# EAGLE board ArduinoDevBoardRevA (EAGLE 9.0.1), part 1 of 2
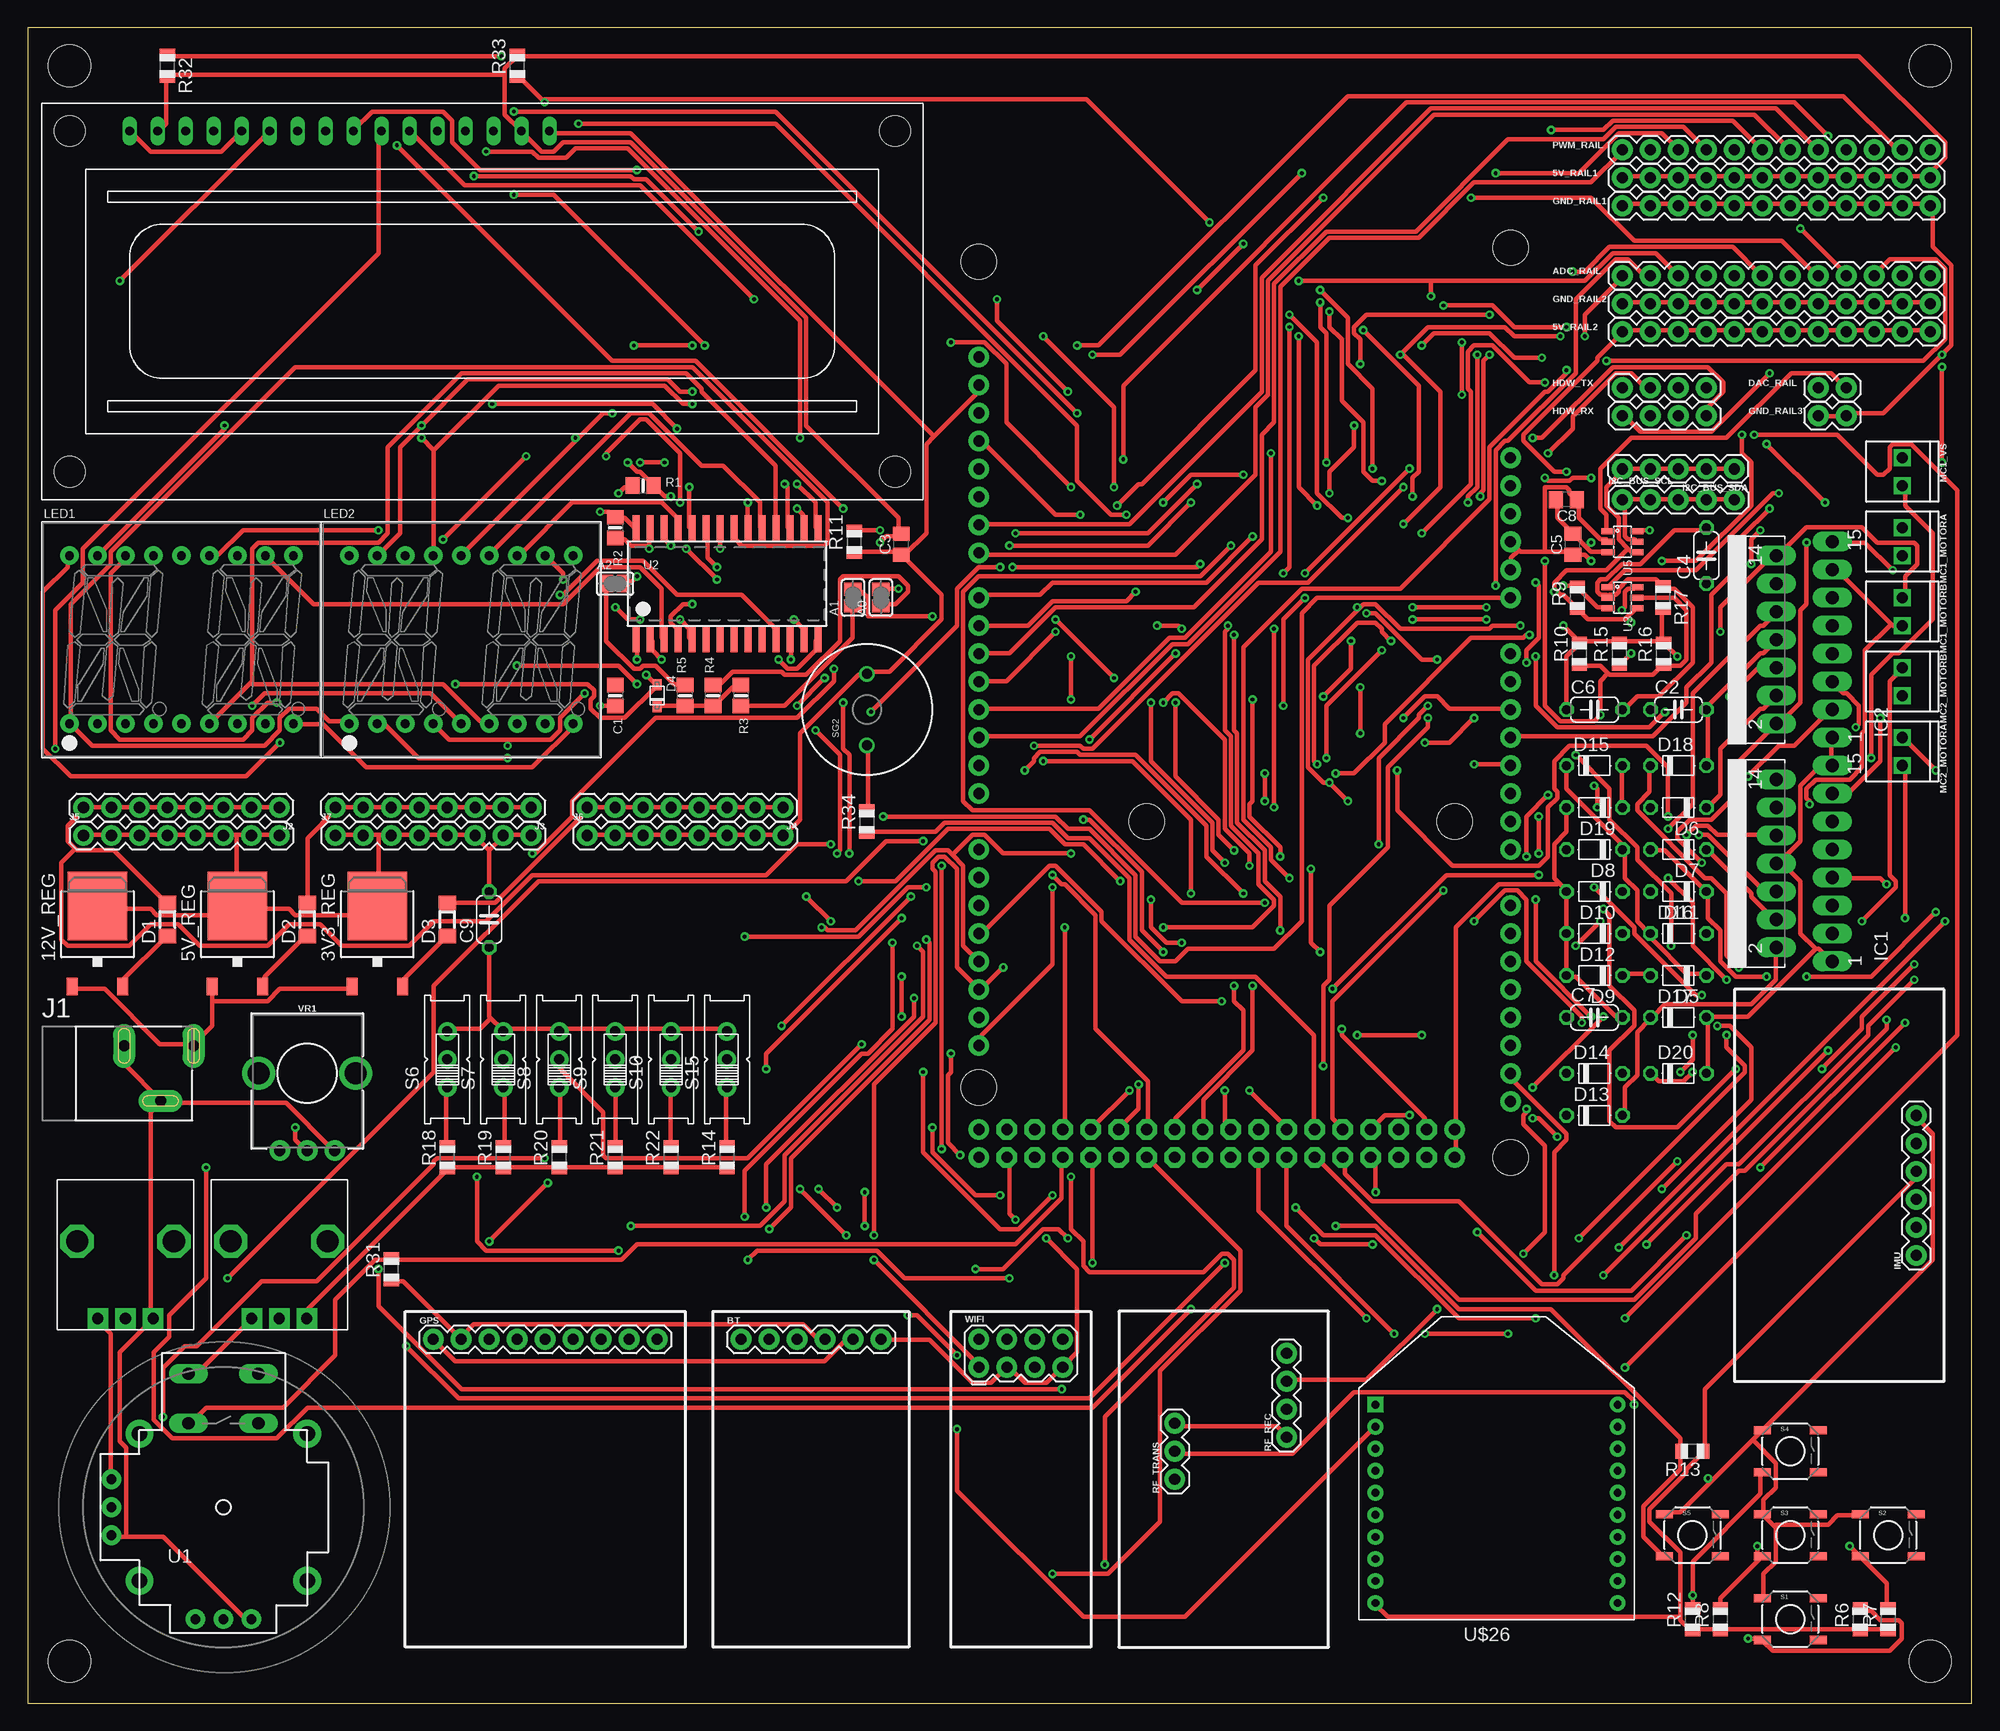
[diagram p2: board, top side]
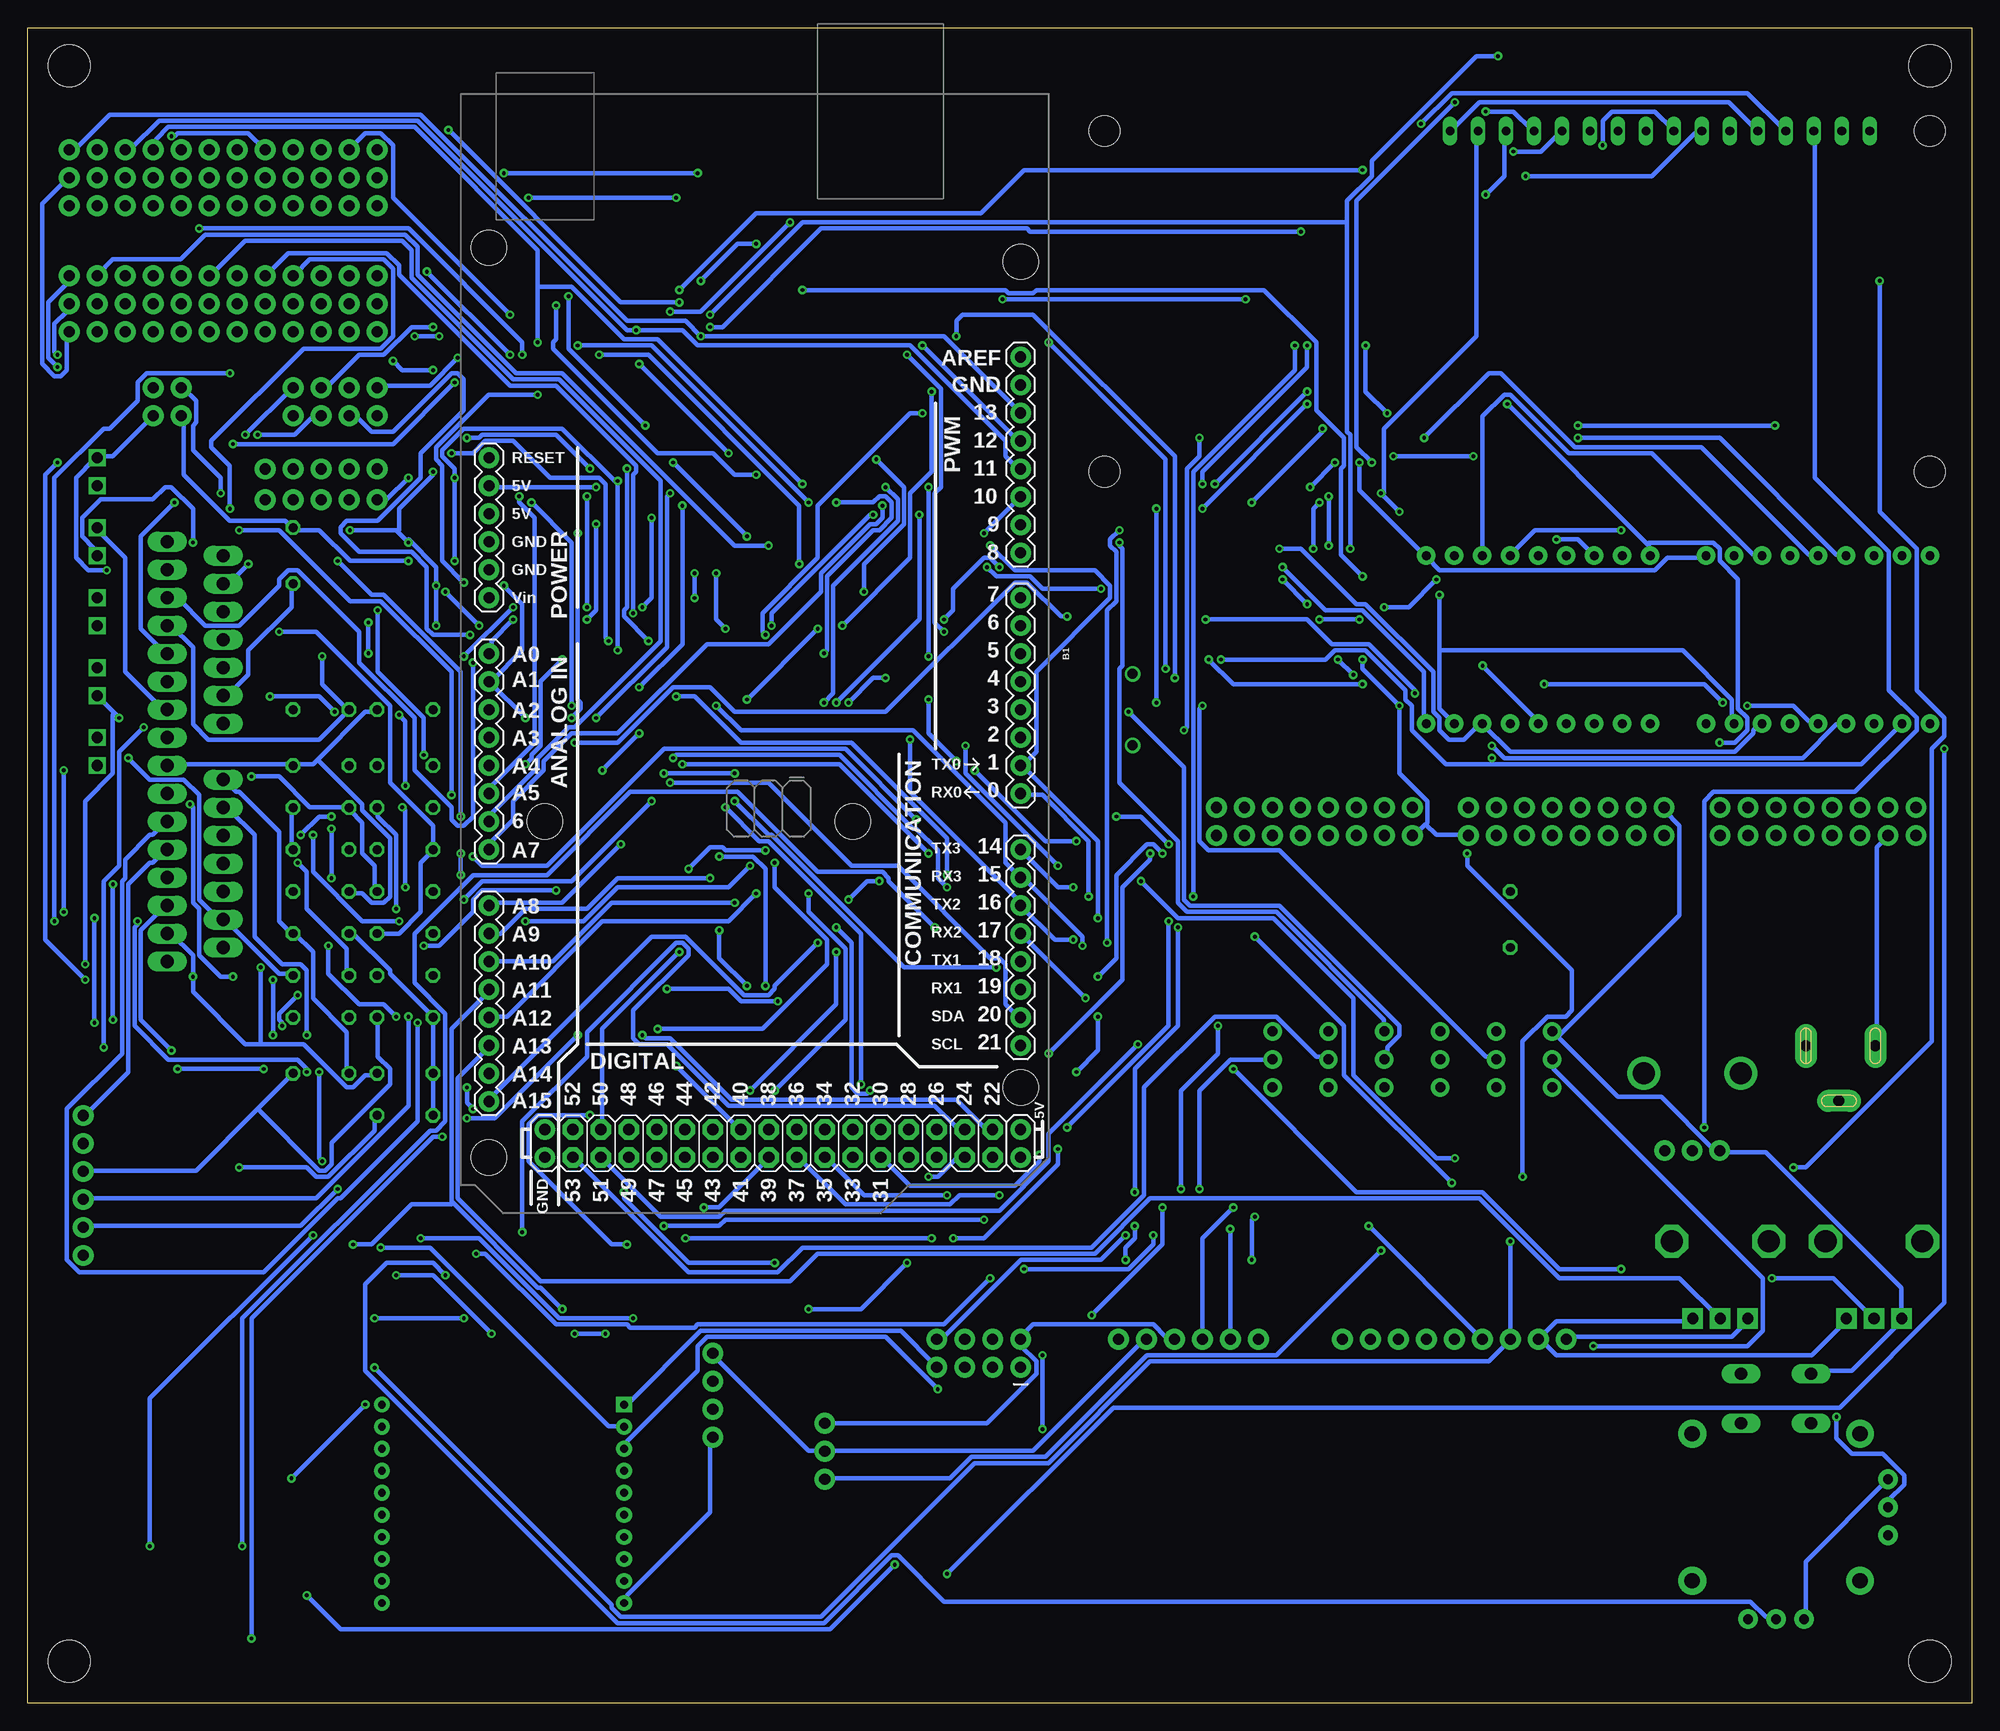
[diagram p3: board, bottom side, seen from below]

Size 176.51 x 152.07 mm. Coordinates in mm from the lower left corner, seen from the top.
Outline: 0,0 176.51,0 176.51,152.07 0,152.07 0,0
Copper layers (1*16): Top 0.035mm / dielectric 1.5mm / Bottom 0.035mm
Design rules "default": minimum track width 6mil, minimum drill 0.35mm, track to track 6mil, track to pad 6mil, pad to pad 6mil, via to via 6mil, smd to smd 6mil, copper to edge 40mil, drill to drill 6mil, minimum pad ring 10mil, minimum via ring 8mil, stop-mask expansion 4mil, vias tented up to drill 0mil, thermal gap 10mil
Net classes: 0 default: width 0.406 mm
Holes 3.81 mm at 3.81,148.59 172.72,148.59 172.72,3.81 3.81,3.81

## Footprints (pad centres in the part's own frame; a part is rotated, then mirrored left to right if it is on the bottom)
TO252 = smd 1 x 1.6: 1 -2.28,-4.8; 2 2.28,-4.8 | smd 5.4 x 6.2: 3 0,2.5
1X12 = drill 1.016 pad 1.88: 1 0,0; 2 2.54,0; 3 5.08,0; 4 7.62,0; 5 10.16,0; 6 12.7,0; 7 15.24,0; 8 17.78,0; 9 20.32,0; 10 22.86,0; 11 25.4,0; 12 27.94,0
SOLDERJUMPER_REFLOW_NOPASTE = smd 1.168 x 1.6: 1 -0.762,0; 2 0.762,0
ARDUINO_MEGA = drill 1.016 pad 1.88: 0 13.97,24.13; 1 11.43,24.13; 2 8.89,24.13; 3 6.35,24.13; 3.3V -13.97,-24.13; 4 3.81,24.13; 5 1.27,24.13; 5V@0 -11.43,-24.13; 5V@1 44.45,24.13; 5V@2 46.99,24.13; 6 -1.27,24.13; 7 -3.81,24.13; 8 -7.874,24.13; 9 -10.414,24.13; 10 -12.954,24.13; 11 -15.494,24.13; 12 -18.034,24.13; 13 -20.574,24.13; 14 19.05,24.13; 15 21.59,24.13; 16 24.13,24.13; 17 26.67,24.13; 18 29.21,24.13; 19 31.75,24.13; 20 34.29,24.13; 21 36.83,24.13; A0 1.27,-24.13; A1 3.81,-24.13; A2 6.35,-24.13; A3 8.89,-24.13; A4 11.43,-24.13; A5 13.97,-24.13; A6 16.51,-24.13; A7 19.05,-24.13; A8 24.13,-24.13; A9 26.67,-24.13; A10 29.21,-24.13; A11 31.75,-24.13; A12 34.29,-24.13; A13 36.83,-24.13; A14 39.37,-24.13; A15 41.91,-24.13; AREF -25.654,24.13; GND@0 -8.89,-24.13; GND@1 -6.35,-24.13; GND@2 44.45,-19.05; GND@3 46.99,-19.05; GND@4 -23.114,24.13; RESET -16.51,-24.13; VIN -3.81,-24.13 | drill 1.016 pad 1.88 octagon: 22 44.45,21.59; 23 46.99,21.59; 24 44.45,19.05; 25 46.99,19.05; 26 44.45,16.51; 27 46.99,16.51; 28 44.45,13.97; 29 46.99,13.97; 30 44.45,11.43; 31 46.99,11.43; 32 44.45,8.89; 33 46.99,8.89; 34 44.45,6.35; 35 46.99,6.35; 36 44.45,3.81; 37 46.99,3.81; 38 44.45,1.27; 39 46.99,1.27; 40 44.45,-1.27; 41 46.99,-1.27; 42 44.45,-3.81; 43 46.99,-3.81; 44 44.45,-6.35; 45 46.99,-6.35; 46 44.45,-8.89; 47 46.99,-8.89; 48 44.45,-11.43; 49 46.99,-11.43; 50 44.45,-13.97; 51 46.99,-13.97; 52 44.45,-16.51; 53 46.99,-16.51 | hole 3.2: -34.29,24.13; -35.56,-24.13; 16.51,8.89; 16.51,-19.05; 40.64,24.13; 46.99,-24.13
1X06 = drill 1.016 pad 1.88: 1 0,0; 2 2.54,0; 3 5.08,0; 4 7.62,0; 5 10.16,0; 6 12.7,0
0805-NO = smd 1.3 x 1.5: 1 -0.95,0; 2 0.95,0
C050-024X044 = drill 0.813 octagon: 1 -2.54,0; 2 2.54,0
0805 = smd 1.27 x 1.524: 1 -0.953,0; 2 0.953,0
SOD-123 = smd 1.3 x 1.6: 1 -1.5,0; 2 1.5,0
SOD-323F = smd 1 x 0.8: A -1,0; C 1,0
D-5 = drill 0.813 octagon: A 2.54,0; C -2.54,0
1X02 = drill 1.016 pad 1.88: 1 0,0; 2 2.54,0
1X09 = drill 1.016 pad 1.88: 1 0,0; 2 2.54,0; 3 5.08,0; 4 7.62,0; 5 10.16,0; 6 12.7,0; 7 15.24,0; 8 17.78,0; 9 20.32,0
1X04 = drill 1.016 pad 1.88: 1 0,0; 2 2.54,0; 3 5.08,0; 4 7.62,0
1X05 = drill 1.016 pad 1.88: 1 0,0; 2 2.54,0; 3 5.08,0; 4 7.62,0; 5 10.16,0
MULTIWATT-15 = drill 1.2 long: 1 -8.89,-7.62; 2 -7.62,-2.54; 3 -6.35,-7.62; 4 -5.08,-2.54; 5 -3.81,-7.62; 6 -2.54,-2.54; 7 -1.27,-7.62; 8 0,-2.54; 9 1.27,-7.62; 10 2.54,-2.54; 11 3.81,-7.62; 12 5.08,-2.54; 13 6.35,-7.62; 14 7.62,-2.54; 15 8.89,-7.62
POWER_JACK_SLOT = drill 1 pad 2 long: GND@1 2.58,7.5; GND@2 7.58,10.8; PWR 2.58,13.8
1X08 = drill 1.016 pad 1.88: 1 0,0; 2 2.54,0; 3 5.08,0; 4 7.62,0; 5 10.16,0; 6 12.7,0; 7 15.24,0; 8 17.78,0
SEGMENT_STARTBUST_DUAL_KWA-541CBB = drill 0.8 pad 1.676: 1 -10.16,-7.62; 2 -7.62,-7.62; 3 -5.08,-7.62; 4 -2.54,-7.62; 5 0,-7.62; 6 2.54,-7.62; 7 5.08,-7.62; 8 7.62,-7.62; 9 10.16,-7.62; 10 10.16,7.62; 11 7.62,7.62; 12 5.08,7.62; 13 2.54,7.62; 14 0,7.62; 15 -2.54,7.62; 16 -5.08,7.62; 17 -7.62,7.62; 18 -10.16,7.62
1X02_2.54_SCREWTERM = drill 1.016 square: P1 2.54,0; P2 0,0
R0805 = smd 1.1 x 1.4: 1 -1,0; 2 1,0
1X03 = drill 1.016 pad 1.88: 1 0,0; 2 2.54,0; 3 5.08,0
TACTILE_SWITCH_SMD = smd 1.524 x 0.762: 1 -2.54,1.905; 2 2.54,1.905; 3 -2.54,-1.905; 4 2.54,-1.905
EG1218 = drill 0.9 pad 1.676: O -2.54,0; P 0,0; S 2.54,0
BUZZER-12MM = drill 0.9: + 3.25,0; - -3.25,0
JOYSTICK = drill 1.1 pad 1.778 long: B1A -3.175,12.12; B1B 3.175,12.12; B2A -3.175,7.62; B2B 3.175,7.62 | drill 0.889 pad 1.778: H1 -2.54,-10.16; H2 0,-10.16; H3 2.54,-10.16; V1 -10.16,2.54; V2 -10.16,0; V3 -10.16,-2.54 | drill 1.397 pad 2.54: MOUNT1 -7.62,6.668; MOUNT2 -7.62,-6.668; MOUNT3 7.62,-6.668; MOUNT4 7.62,6.668
SOP28_300MIL = smd 0.635 x 2.286: P$1 -8.255,-5.08; P$2 -6.985,-5.08; P$3 -5.715,-5.08; P$4 -4.445,-5.08; P$5 -3.175,-5.08; P$6 -1.905,-5.08; P$7 -0.635,-5.08; P$8 0.635,-5.08; P$9 1.905,-5.08; P$10 3.175,-5.08; P$11 4.445,-5.08; P$12 5.715,-5.08; P$13 6.985,-5.08; P$14 8.255,-5.08; P$15 8.255,5.08; P$16 6.985,5.08; P$17 5.715,5.08; P$18 4.445,5.08; P$19 3.175,5.08; P$20 1.905,5.08; P$21 0.635,5.08; P$22 -0.635,5.08; P$23 -1.905,5.08; P$24 -3.175,5.08; P$25 -4.445,5.08; P$26 -5.715,5.08; P$27 -6.985,5.08; P$28 -8.255,5.08
SOT23-6 = smd 0.55 x 1.2: 1 -0.95,-1.3; 2 0,-1.3; 3 0.95,-1.3; 4 0.95,1.3; 5 0,1.3; 6 -0.95,1.3
ALPS_POT = drill 1 pad 1.88 square: P$1 7,-2.5; P$2 7,0; P$3 7,2.5 | drill 2 octagon: P$4 0,-4.4; P$5 0,4.4
XBEE = drill 0.7 pad 1.422 square: 1 -11,5.5 | drill 0.7 pad 1.422: 2 -11,3.5; 3 -11,1.5; 4 -11,-0.5; 5 -11,-2.5; 6 -11,-4.5; 7 -11,-6.5; 8 -11,-8.5; 9 -11,-10.5; 10 -11,-12.5; 11 11,-12.5; 12 11,-10.5; 13 11,-8.5; 14 11,-6.5; 15 11,-4.5; 16 11,-2.5; 17 11,-0.5; 18 11,1.5; 19 11,3.5; 20 11,5.5
POT-PTH-ALPS-KIT = drill 1 pad 1.88: P$1 7,-2.5; P$2 7,0; P$3 7,2.5 | drill 2: P$4 0,-4.4; P$5 0,4.4
2X4 = drill 1.016 pad 1.88: 1 -3.81,-1.27; 2 -3.81,1.27; 3 -1.27,-1.27; 4 -1.27,1.27; 5 1.27,-1.27; 6 1.27,1.27; 7 3.81,-1.27; 8 3.81,1.27
LCD1602 = drill 0.8 long: 1 8,33.46; 2 10.54,33.46; 3 13.08,33.46; 4 15.62,33.46; 5 18.16,33.46; 6 20.7,33.46; 7 23.24,33.46; 8 25.78,33.46; 9 28.32,33.46; 10 30.86,33.46; 11 33.4,33.46; 12 35.94,33.46; 13 38.48,33.46; 14 41.02,33.46; 15 43.56,33.46; 16 46.1,33.46 | hole 2.8: 2.54,2.54; 2.54,33.46; 77.46,33.46; 77.46,2.54

## Placement (x,y rotation side)
3V3_REG  7812DT  [TO252]  31.75,69.85 0 top
5V_RAIL1  [1X12]  144.78,138.43 0 top
5V_RAIL2  [1X12]  144.78,124.46 0 top
5V_REG  7812DT  [TO252]  19.05,69.85 0 top
12V_REG  7812DT  [TO252]  6.35,69.85 0 top
A0  [SOLDERJUMPER_REFLOW_NOPASTE]  77.47,100.33 90 top
A1  [SOLDERJUMPER_REFLOW_NOPASTE]  74.93,100.33 90 top
A2  [SOLDERJUMPER_REFLOW_NOPASTE]  53.34,101.6 0 top
ADC_RAIL  [1X12]  144.78,129.54 0 top
B1  ARDUINO_MEGA_R3FULL  [ARDUINO_MEGA]  110.49,96.52 270 bottom
BT  [1X06]  64.77,33.02 0 top
C1  10uF  [0805-NO]  53.34,91.44 270 top
C2  100nF  [C050-024X044]  149.86,90.17 0 top
C3  0.1uF  [0805]  79.31,105.18 90 top
C4  100nF  [C050-024X044]  152.4,104.14 90 top
C5  0.1uF  [0805]  140.27,105.18 90 top
C6  100nF  [C050-024X044]  142.24,90.17 0 top
C7  100nF  [C050-024X044]  142.24,62.23 0 top
C8  0.1uF  [0805]  139.7,109.22 180 top
C9  4.7uF  [C050-024X044]  41.91,71.12 90 top
D1  [SOD-123]  12.7,71.12 90 top
D2  [SOD-123]  25.4,71.12 90 top
D3  [SOD-123]  38.1,71.12 90 top
D4  1N4148  [SOD-323F]  57.15,91.44 270 top
D5  [D-5]  149.86,66.04 180 top
D6  [D-5]  149.86,81.28 180 top
D7  [D-5]  149.86,77.47 180 top
D8  [D-5]  142.24,77.47 180 top
D9  [D-5]  142.24,66.04 180 top
D10  [D-5]  142.24,73.66 180 top
D11  [D-5]  149.86,73.66 180 top
D12  [D-5]  142.24,69.85 180 top
D13  [D-5]  142.24,53.34 0 top
D14  [D-5]  142.24,57.15 0 top
D15  [D-5]  142.24,85.09 0 top
D16  [D-5]  149.86,69.85 0 top
D17  [D-5]  149.86,62.23 0 top
D18  [D-5]  149.86,85.09 0 top
D19  [D-5]  142.24,81.28 180 top
D20  [D-5]  149.86,57.15 0 top
DAC_RAIL  [1X02]  162.56,119.38 0 top
GND_RAIL1  [1X12]  144.78,135.89 0 top
GND_RAIL2  [1X12]  144.78,127 0 top
GND_RAIL3  [1X02]  162.56,116.84 0 top
GPS  [1X09]  36.83,33.02 0 top
HDW_RX  [1X04]  144.78,116.84 0 top
HDW_TX  [1X04]  144.78,119.38 0 top
I2C_BUS_SCL  [1X05]  144.78,109.22 0 top
I2C_BUS_SDA  [1X05]  154.94,112.01 180 top
IC1  L298  [MULTIWATT-15]  156.21,76.2 90 top
IC2  L298  [MULTIWATT-15]  156.21,96.52 90 top
IMU  [1X06]  171.45,40.64 90 top
J1  POWER_JACKSLT  [POWER_JACK_SLOT]  1.27,62.23 270 top
J2  [1X08]  22.86,81.28 180 top
J3  [1X08]  45.72,81.28 180 top
J4  [1X08]  68.58,81.28 180 top
J5  [1X08]  5.08,78.74 0 top
J6  [1X08]  50.8,78.74 0 top
J7  [1X08]  27.94,78.74 0 top
LED1  [SEGMENT_STARTBUST_DUAL_KWA-541CBB]  13.97,96.52 0 top
LED2  [SEGMENT_STARTBUST_DUAL_KWA-541CBB]  39.37,96.52 0 top
MC1_MOTORA  [1X02_2.54_SCREWTERM]  170.18,106.68 270 top
MC1_MOTORB  [1X02_2.54_SCREWTERM]  170.18,100.33 270 top
MC1_VS  [1X02_2.54_SCREWTERM]  170.18,113.03 270 top
MC2_MOTORA  [1X02_2.54_SCREWTERM]  170.18,87.63 270 top
MC2_MOTORB  [1X02_2.54_SCREWTERM]  170.18,93.98 270 top
PWM_RAIL  [1X12]  144.78,140.97 0 top
R1  10K  [0805-NO]  55.88,110.49 0 top
R2  10K  [0805-NO]  53.34,106.68 270 top
R3  47K  [0805-NO]  64.77,91.44 270 top
R4  47K  [0805-NO]  62.23,91.44 90 top
R5  47K  [0805-NO]  59.69,91.44 90 top
R6  [R0805]  166.37,7.62 90 top
R7  [R0805]  168.91,7.62 90 top
R8  [R0805]  153.67,7.62 90 top
R9  10k  [R0805]  140.69,100.32 90 top
R10  10k  [R0805]  140.87,95.25 90 top
R11  10k  [R0805]  75.05,105.4 90 top
R12  [R0805]  151.13,7.62 90 top
R13  [R0805]  151.13,22.86 180 top
R14  10K  [R0805]  63.5,49.53 90 top
R15  10k  [R0805]  144.5,95.24 90 top
R16  10k  [R0805]  148.51,95.24 90 top
R17  10k  [R0805]  148.47,100.34 270 top
R18  10K  [R0805]  38.1,49.53 90 top
R19  10K  [R0805]  43.18,49.53 90 top
R20  10K  [R0805]  48.26,49.53 90 top
R21  10K  [R0805]  53.34,49.53 90 top
R22  10K  [R0805]  58.42,49.53 90 top
R31  10k  [R0805]  33.02,39.37 90 top
R32  10k  [R0805]  12.7,148.59 270 top
R33  10k  [R0805]  44.45,148.59 90 top
R34  100  [R0805]  76.2,80.01 90 top
RF_REC  [1X04]  114.3,24.13 90 top
RF_TRANS  [1X03]  104.14,20.32 90 top
S1  [TACTILE_SWITCH_SMD]  160.02,7.62 0 top
S2  [TACTILE_SWITCH_SMD]  168.91,15.24 0 top
S3  [TACTILE_SWITCH_SMD]  160.02,15.24 0 top
S4  [TACTILE_SWITCH_SMD]  160.02,22.86 0 top
S5  [TACTILE_SWITCH_SMD]  151.13,15.24 0 top
S6  [EG1218]  38.1,58.42 90 top
S7  [EG1218]  43.18,58.42 90 top
S8  [EG1218]  48.26,58.42 90 top
S9  [EG1218]  53.34,58.42 90 top
S10  [EG1218]  58.42,58.42 90 top
S15  [EG1218]  63.5,58.42 90 top
SG2  BUZZERPTH  [BUZZER-12MM]  76.2,90.17 90 top
U1  JOYSTICKPTH  [JOYSTICK]  17.78,17.78 0 top
U2  [SOP28_300MIL]  63.5,101.6 0 top
U3  MCP4725A1T-E/CH  [SOT23-6]  144.78,100.33 270 top
U5  MCP4725A1T-E/CH  [SOT23-6]  144.78,105.41 270 top
U$12  POT  [ALPS_POT]  22.86,41.91 270 top
U$14  POT  [ALPS_POT]  8.89,41.91 270 top
U$26  XBEE  [XBEE]  133.35,21.59 0 top
VR1  10k  [POT-PTH-ALPS-KIT]  25.4,57.15 270 top
WIFI  [2X4]  90.17,31.75 0 top
X1  HD44780LCD-1602  [LCD1602]  1.27,109.22 0 top

## Tracks (layer width: path | path; a pad name or v marks a point on that pad's centre or on a via)
3.3V  (via drill 0.35)
  Top 0.406: BT.6 77.67,32.97 81.86,32.97 85.78,29.06 87.45,29.06 88.85,30.45 WIFI.3 89.13,30.45 90.53,29.06 92.48,29.06 93.88,30.45 WIFI.7 94.16,30.73 95.28,31.85 95.28,39.4 v92.48,42.19 | v124.89,110.36 116.23,101.7 111.76,101.7 96.67,86.61 95.83,86.61 95.56,86.89 v91.36,86.89 | v82.98,50.29 v82.98,76
  Bottom 0.406: U$26.1 122.1,27.1 115.39,33.81 97.23,33.81 94.16,30.73 WIFI.7 | v124.89,110.36 134.39,110.36 B1.3.3V | v91.36,86.89 91.36,84.38 v82.98,76 | v82.98,50.29 82.98,48.9 89.69,42.19 v92.48,42.19
5V  (via drill 0.35)
  Top 0.406: U3.3 143.33,99.47 142.49,99.47 140.82,101.14 R9.2 140.54,101.42 v139.42,101.42 | 141.52,104.92 140.54,105.89 C5.2 140.26,106.17 138.86,107.57 138.86,108.97 C8.2 | 141.52,104.92 141.94,104.5 143.33,104.5 U5.3 | v147.24,106.45 146.13,106.45 U5.6 | 141.52,104.92 v141.94,105.33 | 148.36,96.39 148.36,99.19 R17.2 | R10.2 141.1,96.39 144.45,96.39 R15.2 144.73,96.39 148.36,96.39 | 148.36,96.39 R16.2 148.64,96.11 v149.76,95 | C6.1 139.7,95 140.82,96.11 R10.2 | v139.42,97.79 140.82,96.39 R10.2 | 5V_RAIL2.12 172.67,124.61 170.43,124.61 5V_RAIL2.11 170.16,124.61 167.64,124.61 | 167.64,124.61 165.12,124.61 5V_RAIL2.9 164.85,124.61 162.61,124.61 5V_RAIL2.8 162.33,124.61 160.1,124.61 5V_RAIL2.7 159.82,124.61 157.58,124.61 5V_RAIL2.6 157.3,124.61 155.07,124.61 5V_RAIL2.5 154.79,124.61 152.55,124.61 5V_RAIL2.4 152.27,124.61 150.04,124.61 5V_RAIL2.3 149.76,124.61 147.52,124.61 5V_RAIL2.2 147.24,124.61 145.01,124.61 5V_RAIL2.1 144.73,124.33 142.49,122.1 142.49,121.82 135.79,115.11 135.79,114.55 138.58,111.76 v139.7,111.76 | 167.64,124.61 5V_RAIL2.10 | 5V_RAIL1.1 145.01,138.58 147.24,138.58 5V_RAIL1.2 147.52,138.58 149.76,138.58 5V_RAIL1.3 150.04,138.58 152.27,138.58 5V_RAIL1.4 152.55,138.58 154.79,138.58 5V_RAIL1.5 155.07,138.58 157.3,138.58 5V_RAIL1.6 157.58,138.58 159.82,138.58 5V_RAIL1.7 160.1,138.58 162.33,138.58 5V_RAIL1.8 162.61,138.58 164.85,138.58 5V_RAIL1.9 165.12,138.58 167.64,138.58 | 167.64,138.58 170.16,138.58 5V_RAIL1.11 170.43,138.58 172.67,138.58 5V_RAIL1.12 172.95,138.58 172.95,139.14 174.07,140.26 174.07,141.66 166.24,149.48 44.7,149.48 R33.2 44.42,149.48 43.31,148.36 43.31,147.8
  Top 0.406: 167.64,138.58 5V_RAIL1.10 | U2.P$28 55.04,106.73 54.2,107.57 53.37,107.57 R2.1 53.09,107.85 52.81,108.13 v51.97,108.13 | v53.65,109.8 54.2,110.36 54.76,110.36 R1.1 | X1.2 12.01,142.77 12.57,143.33 12.57,147.52 R32.2 12.85,147.8 43.31,147.8 | 43.31,147.8 43.31,144.17 44.7,142.77 X1.15 44.98,142.49 46.66,140.82 47.78,140.82 48.62,141.66 54.76,141.66 70.69,125.73 70.69,115.95 79.07,107.57 79.07,106.17 C3.2 79.07,105.89 77.95,105.89 v77.39,105.33 | 158.56,16.07 S3.1 157.58,17.32 157.58,18.44 158.7,19.56 158.7,21.79 156.6,23.89 | 158.56,16.07 158.7,15.93 158.7,12.85 157.58,11.73 157.58,9.78 S1.1 | S2.1 166.24,17.04 164.29,17.04 163.45,16.2 158.7,16.2 158.56,16.07 | 156.6,23.89 S4.1 172.95,40.23 172.95,51.69 171.55,53.09 IMU.6 | 156.6,23.89 152.97,20.26 | 152.97,20.26 150.04,17.32 148.64,17.32 S5.1 | D2.2 25.43,72.64 25.43,78.51 27.94,81.03 J3.8 27.94,81.31 30.45,81.31 J3.7 30.73,81.31 32.97,81.31 J3.6 33.25,81.31 35.48,81.31 J3.5 35.76,81.31 38,81.31 J3.4 38.28,81.31 40.51,81.31 J3.3 40.79,81.31 43.03,81.31 J3.2 43.31,81.31 45.54,81.31 J3.1 | S15.S 63.42,61.19 58.67,61.19 S10.S 58.4,61.19 53.37,61.19 S9.S 53.09,61.19 48.34,61.19 S8.S 48.06,61.19 43.31,61.19 S7.S 43.03,61.19 42.05,62.17 | C9.1 41.91,62.31 42.05,62.17 | 42.05,62.17 41.07,61.19 38.28,61.19 S6.S | U1.B1A 14.81,30.18 15.65,30.18 20.12,34.65 U$12.P$1 | U1.V1 7.54,20.4 7.54,33.53 6.43,34.65 U$14.P$1 | GPS.1 38.84,31.01 72.36,31.01 74.32,32.97 74.88,32.97 BT.5 | v152.55,20.4 152.83,20.4 152.97,20.26 | v145.85,27.1 145.85,27.38 145.01,28.22 120.42,28.22 114.83,22.63 104.22,22.63 RF_TRANS.2
  Bottom 0.406: v147.24,106.45 143.05,106.45 142.91,106.31 | 142.91,106.31 v141.94,105.33 141.94,105.61 139.42,103.1 v139.42,101.42 v139.42,97.79 | IC2.9 163.45,97.79 161.49,95.83 161.49,88.85 160.1,87.45 150.04,87.45 C2.1 147.52,90.25 149.76,92.48 v149.76,95 | 5V_RAIL2.12 172.95,124.33 172.95,120.98 173.51,120.42 174.07,120.42 175.18,121.54 175.18,136.07 172.95,138.3 5V_RAIL1.12 | v139.7,111.76 139.7,111.48 142.77,108.41 142.77,106.45 142.91,106.31 | v51.97,108.13 v53.65,109.8 53.37,109.8 53.37,115.67 44.98,124.05 44.98,142.49 X1.15 | IC1.9 164.01,77.39 165.12,76.28 165.41,76.28 167.36,74.32 167.36,57.28 171.27,53.37 IMU.6 | J3.8 27.94,81.03 26.54,79.63 26.54,71.53 37.44,60.63 S6.S 38,60.91 32.13,55.04 28.22,55.04 23.47,50.29 22.91,50.29 VR1.P$1 22.63,50.01 18.72,50.01 6.43,37.72 6.43,34.92 U$14.P$1 6.43,34.65 10.9,30.18 14.53,30.18 U1.B1A | RF_REC.4 114.28,31.57 105.61,22.91 104.22,22.91 RF_TRANS.2 103.94,22.91 85.22,22.91 75.16,32.97 BT.5 | GPS.1 36.6,33.25 21.79,33.25 20.4,34.65 U$12.P$1 | U1.V1 15.09,12.85 15.09,7.82 U1.H1 | v145.85,27.1 v152.55,20.4 | v77.39,105.33 77.39,105.05 77.11,104.78 77.11,94.16 77.39,93.88 77.39,83.54 72.08,78.23 72.08,72.64 71.25,71.81 63.14,71.81 53.37,62.03 53.37,61.19 S9.S
12V  (via drill 0.35)
  Top 0.406: J2.1 22.63,81.31 20.4,81.31 J2.2 20.12,81.31 17.88,81.31 J2.3 17.6,81.31 15.37,81.31 J2.4 15.09,81.31 12.85,81.31 J2.5 12.57,81.31 10.34,81.31 J2.6 10.06,81.31 7.82,81.31 J2.7 7.54,81.31 5.31,81.31 J2.8 5.03,81.03 3.63,79.63 3.63,78.23 4.33,77.53 | 4.33,77.53 4.47,77.39 7.82,77.39 12.57,72.64 D1.2 | v77.67,80.47 93.32,80.47 94.44,79.35 96.39,79.35 100.58,75.16 100.58,69.57 102.82,67.33 104.22,67.33 105.33,68.45 113.16,68.45 115.67,70.97 115.67,98.91 117.07,100.31 134.39,100.31 B1.VIN | v72.92,77.95 69.85,77.95 67.06,75.16 45.82,75.16 41.63,70.97 36.88,70.97 34.65,68.73 28.5,68.73 26.54,70.69 23.75,70.69 21.79,68.73 15.65,68.73 13.69,70.69 11.18,70.69 9.22,68.73 3.63,68.73 3.07,69.29 3.07,76.28 4.33,77.53
  Bottom 0.406: v77.67,80.47 75.44,80.47 v72.92,77.95
A0  (via drill 0.35)
  Top 0.406: v62.59,103.1 61.75,103.94 61.75,106.45 U2.P$23 | LED1.9 24.31,88.85 26.82,88.85 30.73,84.94 45.82,84.94 49.73,88.85 LED2.9
  Bottom 0.406: v62.59,103.1 58.67,99.19 55.32,99.19 49.73,93.6 49.73,89.13 LED2.9
A1  (via drill 0.35)
  Top 0.406: v60.07,110.36 60.07,106.73 U2.P$24 | v55.6,112.6 v57.84,112.6
  Bottom 0.406: v57.84,112.6 v60.07,110.36 | v55.6,112.6 55.6,110.08 49.73,104.22 LED2.10 49.45,103.94 48.34,102.82 28.78,102.82 27.66,103.94 24.31,103.94 LED1.10
A2
  Top 0.406: U2.P$25 58.95,106.73 58.95,107.57 57.56,108.97 49.45,108.97 44.7,104.22 LED2.12
  Bottom 0.406: LED1.12 19.28,104.22 19.84,104.22 29.06,113.44 36.6,113.44 41.91,118.75 42.47,118.75 44.42,116.79 44.42,104.22 LED2.12
ADC1  (via drill 0.35)
  Top 0.406: v79.07,101.14 77.67,101.14 A0.2 | v89.41,103.1 106.17,103.1 v106.45,103.38 | v139.14,124.05 134.95,124.05 134.11,124.89 127.13,124.89 v124.61,122.38 124.89,122.38 128.25,119.02 128.25,110.36 v124.89,107.01 | v141.38,124.05 141.38,126.01 144.73,129.36 ADC_RAIL.1 | v125.73,98.35 v132.44,98.35
  Bottom 0.406: v79.07,101.14 84.38,101.14 85.5,102.26 88.57,102.26 v89.41,103.1 | v106.45,103.38 106.45,108.69 120.14,122.38 v124.61,122.38 | v141.38,124.05 v139.14,124.05 | v132.44,98.35 134.39,96.39 134.39,95.28 B1.A0 | v125.73,98.35 124.89,99.19 v124.89,107.01
ADC2  (via drill 0.35)
  Top 0.406: v82.14,98.63 76.28,98.63 76.28,100.31 75.72,100.86 75.16,100.86 A1.2 | v126.85,87.17 129.08,87.17 v131.32,89.41 | v133.27,101.42 133.27,113.72 134.11,114.55 134.39,114.55 140.54,120.7 140.54,127.41 144.17,131.04 145.29,131.04 146.69,129.64 147.24,129.64 ADC_RAIL.2
  Bottom 0.406: v82.14,98.63 82.7,98.63 85.78,101.7 86.89,101.7 98.63,89.97 112.32,89.97 114.55,92.2 117.91,92.2 122.94,87.17 v126.85,87.17 | v131.32,89.41 B1.A1 134.39,92.76 131.6,95.56 131.6,99.75 v133.27,101.42
ADC3  (via drill 0.35)
  Top 0.406: v55.32,102.26 54.76,101.7 54.2,101.7 A2.2 | v110.36,132.44 v106.17,128.25 | 127.41,129.08 141.38,129.08 143.89,131.6 147.8,131.6 ADC_RAIL.3 | 127.41,129.08 v115.39,129.08 | v124.89,89.41 126.85,91.36 127.97,91.36 129.08,90.25 134.39,90.25 B1.A2 | v118.19,109.8 118.19,111.76 120.42,114 v120.42,115.95 | 127.41,129.08 v127.41,127.69
  Bottom 0.406: v55.32,102.26 57.28,104.22 57.28,112.04 57,112.32 57,114.83 59.51,117.35 59.51,123.5 64.26,128.25 84.94,128.25 85.22,127.97 87.45,127.97 87.73,128.25 v106.17,128.25 | v110.36,132.44 112.04,132.44 v115.39,129.08 | v124.89,89.41 118.47,95.83 118.47,109.53 v118.19,109.8 | v120.42,115.95 127.41,122.94 v127.41,127.69
ADC4  (via drill 0.35)
  Top 0.406: v158.14,108.41 155.63,105.89 155.63,103.38 152.83,100.58 152.83,94.44 150.6,92.2 150.6,90.81 147.52,87.73 134.67,87.73 B1.A3
  Bottom 0.406: v158.14,108.41 158.14,112.32 159.82,114 159.82,114.55 151.44,122.94 144.45,122.94 143.33,124.05 143.33,130.2 144.17,131.04 150.88,131.04 152.27,129.64 ADC_RAIL.4
ADC5  (via drill 0.35)
  Top 0.406: v131.32,85.22 134.39,85.22 B1.A4 | v127.97,94.72 126.57,94.72 122.38,98.91 v121.54,98.91
  Bottom 0.406: v131.32,85.22 130.76,85.78 130.76,86.06 129.92,86.89 129.92,92.76 v127.97,94.72 | v121.54,98.91 121.54,111.48 121.26,111.76 121.26,112.32 128.52,119.58 132.72,119.58 142.77,129.64 142.77,130.48 143.89,131.6 152.83,131.6 154.79,129.64 ADC_RAIL.5
ADC6  (via drill 0.35)
  Top 0.406: v131.88,109.53 131.88,109.8 132.16,110.08 132.16,121.82 v132.72,122.38 | v140.26,129.92 141.38,129.92 143.61,132.16 154.79,132.16 157.3,129.64 ADC_RAIL.6
  Bottom 0.406: v131.88,109.53 131.88,108.97 130.48,107.57 130.48,87.17 134.39,83.26 134.39,82.7 B1.A5 | v140.26,129.92 v132.72,122.38
ADC7
  Bottom 0.406: B1.A6 134.39,80.19 134.39,80.75 130.2,84.94 130.2,85.78 127.41,88.57 126.85,88.57 119.02,96.39 119.02,110.92 128.25,120.14 132.44,120.14 141.66,129.36 141.66,131.88 142.49,132.72 156.74,132.72 159.82,129.64 ADC_RAIL.7
ADC8  (via drill 0.35)
  Top 0.406: v98.91,108.69 100.86,110.64 101.14,110.64 111.48,120.98 111.48,130.48 v117.63,136.63 | v131.04,136.63 141.94,136.63 145.85,132.72 159.26,132.72 162.33,129.64 ADC_RAIL.8
  Bottom 0.406: v98.91,108.69 98.91,107.57 99.47,107.01 100.03,107.01 104.5,102.54 104.5,100.86 109.25,96.11 114.83,96.11 122.94,88.01 127.13,88.01 129.64,85.5 129.64,84.66 132.44,81.86 132.44,80.19 134.39,78.23 134.39,77.67 B1.A7 | v131.04,136.63 v117.63,136.63
ADC9  (via drill 0.35)
  Top 0.406: v122.66,77.95 122.66,85.78 126.29,89.41 126.29,89.69 v127.13,90.53 | v130.76,108.97 130.76,109.53 131.6,110.36 v131.6,122.38 | v160.93,133.83 165.12,129.64 ADC_RAIL.9
  Bottom 0.406: v122.66,77.95 127.97,72.64 134.39,72.64 B1.A8 | v127.13,90.53 127.13,105.33 v130.76,108.97 | v131.6,122.38 131.6,123.5 141.94,133.83 v160.93,133.83
ADC10  (via drill 0.35)
  Top 0.406: v114.55,74.88 112.88,76.56 112.88,77.67 110.36,80.19 110.36,95.83 115.67,101.14 124.61,101.14 132.72,109.25 132.72,114 137.74,119.02 138.02,119.02 139.7,120.7 v139.7,120.98 | v143.33,121.82 172.11,121.82 174.07,123.77 174.07,130.2 173.23,131.04 169.04,131.04 167.64,129.64 ADC_RAIL.10
  Bottom 0.406: B1.A9 133.55,69.85 131.32,72.08 125.73,72.08 122.94,74.88 v114.55,74.88 | v139.7,120.98 142.49,120.98 v143.33,121.82
ADC11  (via drill 0.35)
  Top 0.406: v112.32,72.64 104.78,72.64 96.39,81.03 85.78,81.03 84.94,81.86 84.94,100.86 86.33,102.26 106.45,102.26 v109.25,105.05
  Bottom 0.406: v112.32,72.64 123.5,72.64 128.8,67.33 134.39,67.33 B1.A10 | v109.25,105.05 112.32,105.05 127.97,120.7 132.16,120.7 141.1,129.64 141.1,132.16 142.22,133.27 160.38,133.27 162.61,131.04 168.76,131.04 170.16,129.64 ADC_RAIL.11
ADC12  (via drill 0.35)
  Top 0.406: v127.97,35.76 121.54,29.34 114.55,29.34 RF_REC.3 | v173.79,112.6 v173.79,121.26 | v171.27,65.66 167.08,61.47 167.08,60.63 155.35,48.9 154.23,48.9 v146.96,41.63
  Bottom 0.406: v127.97,35.76 129.92,37.72 130.2,37.72 137.88,45.4 | 137.88,45.4 138.02,45.54 138.02,61.19 134.67,64.54 B1.A11 | v173.79,121.26 174.62,122.1 174.62,127.13 172.95,128.8 172.95,129.36 ADC_RAIL.12 | v173.79,112.6 174.9,111.48 174.9,69.29 v171.27,65.66 | v146.96,41.63 145.29,41.63 141.66,45.26 138.02,45.26 137.88,45.4
BUTTON1  (via drill 0.35)
  Top 0.406: R6.2 166.52,8.38 167.36,8.38 168.2,7.54 169.88,7.54 170.16,7.26 170.16,5.87 169.04,4.75 158.42,4.75 157.58,5.59 S1.3 157.3,5.87 v156.19,5.87 | v126.57,60.63 v120.7,60.63 | v136.63,53.09 137.19,53.09 v138.86,51.41
  Bottom 0.406: v120.7,60.63 120.42,60.35 118.19,60.35 112.6,54.76 92.2,54.76 89.69,52.25 89.13,52.25 B1.22 | v126.57,60.63 134.11,53.09 v136.63,53.09 | v138.86,51.41 139.7,51.41 156.19,34.92 v156.19,5.87
BUTTON2  (via drill 0.35)
  Top 0.406: S5.3 148.36,13.41 146.69,15.09 146.69,17.88 150.04,21.23 150.04,22.63 R13.2 150.04,22.91 150.04,24.03 138.3,35.76 129.92,35.76 122.38,43.31 v118.75,43.31 | v89.69,43.87 89.13,44.42 89.13,49.45 B1.23
  Bottom 0.406: v89.69,43.87 113.16,43.87 113.72,43.31 v118.75,43.31
BUTTON3  (via drill 0.35)
  Top 0.406: R7.2 168.76,8.66 168.76,10.9 166.52,13.13 S2.3 166.24,13.41 v165.41,14.25 | v131.6,42.75 136.91,37.44 145.57,37.44 v150.6,42.47
  Bottom 0.406: v131.6,42.75 131.6,52.81 125.73,58.67 125.73,60.91 117.63,69.01 117.07,69.01 116.51,68.45 116.51,67.89 121.54,62.87 121.54,60.35 120.98,59.79 118.47,59.79 112.88,54.2 94.16,54.2 92.2,52.25 91.64,52.25 B1.24 | v150.6,42.47 165.41,27.66 v165.41,14.25
BUTTON4  (via drill 0.35)
  Top 0.406: R12.2 151.16,8.66 v151.16,9.78 151.16,12.85 157.3,19 157.3,20.95 S4.3 | v94.72,47.78 94.72,43.03 95.83,41.91 95.83,39.67 96.39,39.12 106.73,39.12 108.41,40.79 108.97,40.79 109.53,40.23 109.53,37.72 97.79,25.98 v97.79,12.57
  Bottom 0.406: v94.72,47.78 93.88,47.78 92.2,49.45 91.64,49.45 B1.25 | v97.79,12.57 103.66,6.71 148.08,6.71 v151.16,9.78
BUTTON5  (via drill 0.35)
  Top 0.406: R8.2 153.67,9.5 157.3,13.13 S3.3 157.02,13.13 v157.02,14.25 | v94.16,70.41 94.16,52.25 B1.26
  Bottom 0.406: v94.16,70.41 98.35,74.6 98.35,74.88 98.91,75.44 104.78,75.44 112.04,82.7 121.82,82.7 129.36,75.16 136.07,75.16 141.38,69.85 141.38,65.38 138.58,62.59 138.58,52.81 139.42,51.97 139.98,51.97 157.02,34.92 v157.02,14.25
BUZZER
  Top 0.406: R34.1 76.28,79.07 82.42,79.07 83.26,79.91 93.04,79.91 94.44,78.51 96.39,78.51 100.03,74.88 100.03,69.29 103.38,65.94 111.48,65.94 116.79,60.63 116.79,52.25 B1.44
COM0  (via drill 0.35)
  Top 0.406: v56.16,93.32 57,92.48 D4.A 57,92.2 54.2,89.41 51.97,89.41 51.13,90.25 51.13,91.08 51.41,91.36 51.41,91.92 50.85,92.48 v38.84,92.48 | v57.56,94.72 56.72,95.56 56.72,96.39 U2.P$2 | v22.63,90.81 21.79,90.81 20.4,89.41 20.4,88.29 19.56,87.45 8.38,87.45 7.54,88.29 7.54,102.54 8.94,103.94 LED1.16
  Bottom 0.406: v57.56,94.72 v56.16,93.32 | v38.84,92.48 24.31,92.48 v22.63,90.81
COM1
  Top 0.406: LED1.11 25.98,99.75 48.62,99.75 51.97,103.1 55.6,103.1 57.56,101.14 57.56,96.67 U2.P$3
COM2  (via drill 0.35)
  Top 0.406: v60.35,99.75 59.51,99.75 58.4,98.63 58.4,98.07 58.95,97.51 58.95,96.67 U2.P$4 | v59.79,104.78 v62.59,101.98 | v59.23,108.97 59.23,113.44 56.16,116.51 55.6,116.51 52.53,113.44 v52.53,113.16 | v37.72,105.61 v45.26,113.16
  Bottom 0.406: v62.59,101.98 v60.35,99.75 | v59.79,104.78 59.79,108.41 v59.23,108.97 | v45.26,113.16 v52.53,113.16 | v37.72,105.61 35.76,105.61 LED2.16
COM3  (via drill 0.35)
  Top 0.406: v59.23,98.35 60.07,97.51 60.07,96.67 U2.P$5 | v55.6,98.35 54.48,98.35 v53.37,99.47 | v48.62,101.98 48.62,102.54 47.22,103.94 LED2.11
  Bottom 0.406: v55.6,98.35 v59.23,98.35 | v53.37,99.47 51.13,99.47 v48.62,101.98
GND  (via drill 0.35)
  Top 0.406: B1.GND@3 129.64,49.73 129.64,51.97 B1.GND@2 129.64,52.25 129.64,70.41 133.55,74.32 138.86,74.32 139,74.46 | D19.A 139.7,79.07 138.58,77.95 138.58,74.88 139,74.46 | 139,74.46 139.7,73.76 D10.A D12.A D9.A 139.7,65.94 140.54,65.94 144.17,62.31 144.73,62.31 C7.2 | D20.A 152.55,57.28 152.55,62.03 D17.A 152.55,62.31 156.19,62.31 162.33,68.45 | GND_RAIL1.1 145.01,136.07 147.24,136.07 GND_RAIL1.2 147.52,136.07 149.76,136.07 GND_RAIL1.3 150.04,136.07 152.27,136.07 GND_RAIL1.4 152.55,136.07 154.79,136.07 GND_RAIL1.5 155.07,136.07 157.3,136.07 GND_RAIL1.6 157.58,136.07 159.82,136.07 GND_RAIL1.7 160.1,136.07 162.33,136.07 GND_RAIL1.8 162.61,136.07 164.85,136.07 GND_RAIL1.9 165.12,136.07 167.64,136.07 | 167.64,136.07 170.16,136.07 GND_RAIL1.11 170.43,136.07 172.67,136.07 GND_RAIL1.12 172.95,135.79 172.95,132.16 174.62,130.48 174.62,123.22 v173.79,122.38 168.48,117.07 165.12,117.07 GND_RAIL3.2 164.85,116.79 162.61,116.79 GND_RAIL3.1 | 167.64,136.07 GND_RAIL1.10 | GND_RAIL2.1 145.01,127.13 147.24,127.13 GND_RAIL2.2 147.52,127.13 149.76,127.13 GND_RAIL2.3 150.04,127.13 152.27,127.13 GND_RAIL2.4 152.55,127.13 154.79,127.13 GND_RAIL2.5 155.07,127.13 157.3,127.13 GND_RAIL2.6 157.58,127.13 159.82,127.13 GND_RAIL2.7 160.1,127.13 162.33,127.13 GND_RAIL2.8 162.61,127.13 164.85,127.13 GND_RAIL2.9 165.12,127.13 167.64,127.13 | GND_RAIL2.12 172.67,127.13 170.43,127.13 GND_RAIL2.11 170.16,127.13 167.64,127.13 | 167.64,127.13 GND_RAIL2.10 | 162.33,68.45 162.61,68.45 163.73,67.33 IC1.1 | 162.33,68.45 160.93,69.85 160.93,74.6 159.26,76.28 IC1.8 158.98,76.28 160.93,78.23 160.93,83.26 162.61,84.94 163.73,84.94 IC1.15 163.73,85.22 163.73,87.45 IC2.1
  Top 0.406: v169.32,102.82 166.8,105.33 164.01,105.33 IC2.15 | U5.2 143.33,105.61 142.77,105.61 140.82,107.57 140.82,108.97 C8.1 140.54,109.25 139.98,109.8 139.98,110.08 139.7,110.36 137.74,110.36 137.74,104.5 | 137.74,104.5 135.51,104.5 135.37,104.64 | 137.74,104.5 140.26,104.5 C5.1 140.54,104.22 141.38,104.22 v141.94,103.66 | 135.37,104.64 134.67,105.33 B1.GND@0 | 135.37,104.64 134.67,103.94 134.67,103.1 B1.GND@1 | C4.2 152.27,106.45 149.48,106.45 146.41,103.38 144.73,103.38 143.33,101.98 142.77,101.98 142.49,101.7 142.49,100.86 142.77,100.58 143.33,100.58 U3.2 143.61,100.58 144.17,100.58 144.45,100.86 144.45,101.14 145.29,101.98 147.8,101.98 148.36,101.42 R17.1 148.64,101.14 149.48,101.14 151.16,99.47 151.16,94.44 148.08,91.36 146.13,91.36 145.01,90.25 C6.2 | D18.A 152.55,85.22 152.55,89.97 C2.2 152.27,90.25 157.3,95.28 157.58,95.28 158.7,96.39 IC2.8 | R7.1 168.76,6.71 166.52,6.71 R6.1 166.24,6.71 153.67,6.71 | 153.67,6.71 151.16,6.71 R12.1 150.88,6.71 150.04,7.54 150.04,7.82 | 150.04,7.82 150.04,13.69 147.24,16.48 147.24,17.6 150.6,20.95 150.6,21.23 151.99,22.63 R13.1 152.27,22.91 152.27,28.5 171.27,47.5 171.27,48.06 IMU.4 | 153.67,6.71 R8.1 | RF_TRANS.3 104.22,25.15 113.44,25.15 114.28,24.31 RF_REC.1 | 150.04,7.82 123.5,7.82 122.38,8.94 U$26.10 | R31.1 33.25,38.28 34.09,38.28 39.12,33.25 GPS.2 39.4,33.25 40.51,34.37 70.41,34.37 71.53,33.25 72.36,33.25 BT.4 | R14.1 63.42,48.62 58.67,48.62 R22.1 58.4,48.62 53.37,48.62 R21.1 53.09,48.62 48.34,48.62 R20.1 48.06,48.62 43.31,48.62 R19.1 43.03,48.62 38.28,48.62 R18.1 38,48.34 25.43,35.76 25.43,34.92 U$12.P$3
  Top 0.406: 8.94,15.09 7.82,15.09 U1.V3 | 8.94,15.09 12.29,15.09 19.56,7.82 20.12,7.82 U1.H3 | J1.GND@2 12.01,54.48 11.18,53.65 11.18,34.92 U$14.P$3 11.18,34.65 8.38,31.85 8.38,23.75 8.94,23.19 8.94,15.09 | VR1.P$3 27.66,50.29 23.47,54.48 12.29,54.48 J1.GND@2 | J1.GND@1 8.94,59.51 8.94,57.84 12.01,54.76 J1.GND@2 | X1.1 9.5,142.49 11.18,140.82 17.6,140.82 19.28,142.49 X1.5 | R11.1 75.16,104.5 79.07,104.5 C3.1 | C3.1 79.35,104.22 82.98,100.58 82.98,98.35 78.23,93.6 76.28,93.6 SG2.+ 76,93.32 75.44,93.32 70.13,88.01 70.13,80.19 68.73,78.79 J6.8 68.45,78.79 66.22,78.79 J6.7 65.94,78.79 63.7,78.79 J6.6 63.42,78.79 61.19,78.79 J6.5 60.91,78.79 58.67,78.79 J6.4 58.4,78.79 55.88,78.79 | 82.28,114.97 81.58,114.28 81.58,106.17 79.63,104.22 C3.1 | 82.28,114.97 86.33,119.02 86.33,119.58 B1.GND@4 | J5.8 22.63,78.79 20.4,78.79 J5.7 20.12,78.79 19,78.79 | J5.1 5.31,78.79 7.54,78.79 J5.2 7.82,78.79 10.06,78.79 J5.3 10.34,78.79 12.57,78.79 J5.4 12.85,78.79 15.09,78.79 J5.5 15.37,78.79 17.6,78.79 J5.6 17.88,78.79 19,78.79 | 12V_REG.3 6.43,72.08 11.18,72.08 11.73,71.53 18.44,71.53 19,72.08 5V_REG.3 | 19,78.79 19,72.36 5V_REG.3 | 41.91,77.39 C9.2 | 41.91,77.39 40.79,78.51 J7.6 40.51,78.79 38.28,78.79 J7.5 38,78.79 35.76,78.79 J7.4 35.48,78.79 33.25,78.79 J7.3 32.97,78.79 31.85,78.79 | 41.91,77.39 43.03,78.51 J7.7 43.31,78.79 45.54,78.79 J7.8 | J7.1 27.94,78.79 30.45,78.79 J7.2 30.73,78.79 31.85,78.79 | 31.85,78.79 31.85,72.36 3V3_REG.3 31.57,72.08 31.01,71.53 24.31,71.53 23.75,72.08 19.28,72.08 5V_REG.3 | v51.97,90.53 53.09,90.53 C1.2 | v55.32,94.72 55.32,96.39 U2.P$1
  Top 0.406: J6.1 50.85,78.79 53.09,78.79 J6.2 53.37,78.79 55.88,78.79 | 55.88,78.79 J6.3 | 82.28,114.97 54.76,142.49 47.5,142.49 X1.16
  Bottom 0.406: D20.A 155.63,53.92 | 155.63,53.92 161.21,48.34 171.27,48.34 IMU.4 | GND_RAIL3.2 165.12,116.79 168.76,113.16 170.16,113.16 MC1_VS.P2 170.43,112.88 172.11,111.2 172.11,103.94 170.99,102.82 v169.32,102.82 | 150.18,85.64 150.6,85.22 152.27,85.22 D18.A 152.55,85.22 163.73,85.22 IC1.15 | 150.18,85.64 145.85,89.97 145.01,89.97 C6.2 | 150.18,85.64 146.13,81.58 146.13,81.03 143.61,78.51 143.61,73.2 144.17,72.64 145.29,72.64 146.13,73.48 147.24,73.48 D11.A | v141.94,103.66 147.24,103.66 150.04,106.45 152.27,106.45 C4.2 152.55,106.73 153.11,107.29 158.14,107.29 162.33,111.48 162.33,116.79 GND_RAIL3.1 | v173.79,122.38 174.07,122.66 174.07,125.17 172.95,126.29 172.95,126.85 GND_RAIL2.12 | 155.63,53.92 150.04,48.34 149.48,48.34 148.92,48.9 148.92,50.85 143.61,56.16 143.61,57.56 144.73,58.67 144.73,62.03 C7.2 | BT.4 72.64,33.25 73.2,33.25 74.32,34.37 85.22,34.37 86.33,33.25 WIFI.2 86.33,32.97 86.33,32.41 84.94,31.01 84.94,29.9 89.41,25.43 103.94,25.43 RF_TRANS.3 | U$26.10 122.1,9.22 122.1,9.78 114.55,17.32 114.55,24.03 RF_REC.1 | U$12.P$3 25.43,34.65 37.72,34.65 39.12,33.25 GPS.2 39.12,32.97 37.72,31.57 14.53,31.57 11.46,34.65 U$14.P$3 | X1.16 47.22,142.77 44.7,145.29 22.07,145.29 19.56,142.77 X1.5 | 49.59,79.77 50.57,78.79 J6.1 | 49.59,79.77 49.45,79.91 49.45,81.86 51.97,84.38 v51.97,90.53 55.32,93.88 v55.32,94.72 | 49.59,79.77 48.62,78.79 45.82,78.79 J7.8 | J1.GND@1 8.66,59.79 8.66,77.67 7.82,78.51 J5.2
HDW_RX0  (via drill 0.35)
  Top 0.406: v174.07,70.97 v144.45,41.35 | v158.14,120.7 152.83,115.39 146.41,115.39 145.01,116.79 HDW_RX.1 | v68.45,61.47 v80.19,73.2 | v73.48,44.98 v71.81,46.66 | v79.91,35.2 80.75,35.2 v84.38,31.57 | v84.38,24.87 84.38,19.28 95.83,7.82 105.05,7.82 122.1,24.87 U$26.2
  Bottom 0.406: v144.45,41.35 139.98,41.35 123.77,25.15 122.38,25.15 U$26.2 | v174.07,70.97 174.07,111.2 169.6,115.67 169.04,115.67 166.52,118.19 166.52,119.86 165.68,120.7 v158.14,120.7 | v80.19,73.2 80.19,78.23 84.38,82.42 86.33,82.42 B1.0 | v68.45,61.47 68.45,58.95 71.81,55.6 v71.81,46.66 | v73.48,44.98 73.48,41.63 v79.91,35.2 | v84.38,24.87 v84.38,31.57
HDW_RX1  (via drill 0.35)
  Top 0.406: v76.83,42.47 76.83,56.16 82.42,61.75 82.42,75.44 82.14,75.72 82.14,76.28 82.7,76.83 83.26,76.83 84.38,75.72 84.38,66.78 86.33,64.82 B1.19 86.61,64.82 v88.57,66.78 | v136.35,96.95 136.07,96.95 135.79,96.67 131.04,96.67 123.22,88.85 123.22,87.17 120.42,84.38 v118.75,84.38 | v112.32,81.86 v112.32,84.38
  Bottom 0.406: v76.83,42.47 79.07,40.23 86.33,40.23 93.32,33.25 93.88,33.25 WIFI.8 | v136.35,96.95 139.7,96.95 140.26,97.51 140.26,103.1 141.66,104.5 146.41,104.5 148.08,106.17 148.08,106.73 147.52,107.29 144.73,107.29 140.82,111.2 140.82,113.44 136.91,117.35 136.91,120.14 137.47,120.7 138.02,120.7 143.33,115.39 145.29,115.39 146.69,116.79 147.24,116.79 HDW_RX.2 | v112.32,84.38 v118.75,84.38 | v112.32,81.86 109.25,78.79 108.97,78.79 96.95,66.78 v88.57,66.78
HDW_RX2  (via drill 0.35)
  Top 0.406: v67.06,44.98 67.06,48.9 80.47,62.31 v80.47,63.98 | v155.63,115.11 155.63,113.44 156.46,112.6 156.46,108.69 151.44,103.66 v148.36,103.66 | v137.19,77.11 v137.19,80.47 | v137.19,75.16 128.8,75.16 v118.47,64.82 | v108.41,63.7 104.78,63.7 97.51,70.97 97.51,71.81 93.32,76 92.76,76 86.61,69.85 B1.17
  Bottom 0.406: BT.3 69.85,42.19 v67.06,44.98 | v80.47,63.98 86.33,69.85 B1.17 | v155.63,115.11 152.27,115.11 150.6,116.79 150.04,116.79 HDW_RX.3 | v148.36,103.66 145.29,100.58 144.17,100.58 137.19,93.6 v137.19,80.47 | v137.19,75.16 v137.19,77.11 | v118.47,64.82 112.88,64.82 111.76,63.7 v108.41,63.7
HDW_RX3  (via drill 0.35)
  Top 0.406: v54.76,43.31 66.5,43.31 68.73,45.54 68.73,49.73 81.31,62.31 81.31,68.17 v80.75,68.73 | v136.63,114.83 137.47,114.83 143.89,121.26 152.55,121.26 153.95,119.86 153.95,119.02 152.55,117.63 152.55,117.07 HDW_RX.4 | v115.95,102.54 v125.45,112.04 | v115.95,100.31 114,98.35 v114,90.53
  Bottom 0.406: v54.76,43.31 44.7,33.25 GPS.4 | v80.75,68.73 80.75,69.57 86.33,75.16 B1.15 86.61,75.16 87.73,76.28 87.73,79.91 96.11,88.29 111.76,88.29 v114,90.53 | v136.63,114.83 135.51,114.83 135.23,115.11 128.52,115.11 v125.45,112.04 | v115.95,100.31 v115.95,102.54
HDW_TX0  (via drill 0.35)
  Top 0.406: v93.88,28.5 39.4,28.5 31.85,36.04 v31.85,39.4 | v67.06,57.56 67.06,58.95 v79.35,71.25 | v137.47,122.1 134.95,122.1 132.72,124.33 127.69,124.33 v126.57,123.22 | v105.61,108.97 101.7,105.05 v89.13,105.05
  Bottom 0.406: v93.88,28.5 98.63,33.25 114.83,33.25 115.67,32.41 115.67,30.18 122.1,23.75 122.1,23.19 U$26.3 | v31.85,39.4 37.44,39.4 44.42,46.38 55.88,46.38 v67.06,57.56 | v79.35,71.25 79.35,78.23 86.33,85.22 B1.1 86.06,85.22 84.94,86.33 84.94,93.6 78.23,100.31 78.23,101.42 79.63,102.82 86.89,102.82 v89.13,105.05 | v137.47,122.1 139.98,119.58 144.73,119.58 HDW_TX.1 | v126.57,123.22 119.86,123.22 v105.61,108.97
HDW_TX1  (via drill 0.35)
  Top 0.406: v76.83,40.23 86.33,30.73 WIFI.1 | v76,46.38 v76,43.31 | v72.08,70.41 72.36,70.41 72.64,70.13 75.16,70.13 82.42,77.39 83.54,77.39 83.96,76.97 | 83.96,76.97 84.94,76 84.94,68.73 B1.18 | v138.02,113.44 140.26,115.67 140.26,116.79 144.17,120.7 145.57,120.7 146.69,119.58 147.24,119.58 HDW_TX.2 | v123.77,96.39 122.94,97.23 122.94,97.51 122.38,98.07 120.7,98.07 116.79,94.16 116.79,85.5 v117.07,85.22 | v94.72,77.11 88.57,77.11 86.89,78.79 85.78,78.79 83.96,76.97
  Bottom 0.406: v76.83,40.23 76.83,41.35 76,42.19 v76,43.31 | v76,46.38 76,57.56 72.08,61.47 v72.08,70.41 | v138.02,113.44 136.07,113.44 134.95,114.55 132.44,114.55 129.08,111.2 124.61,111.2 124.05,110.64 124.05,96.67 v123.77,96.39 | v117.07,85.22 102.82,85.22 v94.72,77.11
HDW_TX2  (via drill 0.35)
  Top 0.406: v67.33,43.03 69.29,44.98 69.29,49.45 81.86,62.03 81.86,69.01 v81.58,69.29 | v139.7,124.89 134.95,124.89 132.99,126.85 v128.52,126.85 | v110.36,111.48 105.61,111.48 v103.1,108.97 | v96.39,87.45 v104.22,95.28
  Bottom 0.406: v67.33,43.03 67.33,33.25 BT.2 | v81.58,69.29 83.26,69.29 B1.16 86.33,72.64 96.39,82.7 v96.39,87.45 | v139.7,124.89 141.66,124.89 144.17,122.38 146.41,122.38 149.2,119.58 149.76,119.58 HDW_TX.3 | v128.52,126.85 128.52,123.77 128.8,123.5 128.8,122.94 119.3,113.44 114.28,113.44 112.32,111.48 v110.36,111.48 | v103.1,108.97 99.75,108.97 99.19,109.53 98.63,109.53 98.07,108.97 98.07,107.57 99.19,106.45 99.75,106.45 103.94,102.26 103.94,95.56 v104.22,95.28
HDW_TX3  (via drill 0.35)
  Top 0.406: v47.22,47.22 v41.91,41.91 | v65.1,69.57 75.44,69.57 79.91,74.04 v81.58,74.04 | v156.74,115.11 164.29,115.11 167.92,111.48 168.48,111.48 169.04,112.04 169.04,114 169.32,114.28 170.99,114.28 175.18,110.08 175.18,60.63 v145.01,30.45
  Bottom 0.406: v41.91,41.91 GPS.3 41.91,32.97 43.87,31.01 74.6,31.01 83.82,21.79 90.53,21.79 104.5,7.82 122.66,7.82 123.5,8.66 123.5,8.94 v145.01,30.45 | v47.22,47.22 57,57 57,61.47 v65.1,69.57 | v81.58,74.04 82.98,74.04 86.33,77.39 B1.14 | v156.74,115.11 152.55,119.3 HDW_TX.4
JOYSTICK_BUTTON
  Top 0.406: U1.B2A 14.81,25.43 16.2,26.82 23.19,26.82 27.94,31.57 27.94,36.6 31.57,40.23 32.97,40.23 R31.2 33.25,40.23 53.92,40.23 55.32,41.63 89.69,41.63 93.88,45.82 93.88,49.45 B1.27
JOYSTICK_X  (via drill 0.35)
  Top 0.406: v138.58,38.84 138.58,50.01 139.7,51.13 139.7,51.69 134.39,57 B1.A14
  Bottom 0.406: v138.58,38.84 139.7,39.95 143.89,39.95 145.85,38 145.85,30.18 122.94,7.26 104.22,7.26 98.07,13.41 97.51,13.41 93.32,9.22 20.12,9.22 18.72,7.82 17.88,7.82 U1.H2
JOYSTICK_Y  (via drill 0.35)
  Top 0.406: v12.29,25.98 12.29,30.45 14.25,32.41 15.37,32.41 21.23,38.28 26.26,38.28 36.88,48.9 36.88,49.17 37.16,49.45 v46.94,49.45 | v75.44,74.6 78.79,74.6 83.54,79.35 92.76,79.35 94.16,77.95 95.83,77.95 v99.19,74.6 | v101.98,72.92 101.98,70.41 103.38,69.01 v104.78,69.01
  Bottom 0.406: v12.29,25.98 12.29,24.03 10.9,22.63 8.1,22.63 6.15,20.68 6.15,19.84 7.54,18.44 7.54,17.88 U1.V2 | v46.94,49.45 48.62,49.45 56.16,57 56.16,63.98 63.42,71.25 72.08,71.25 v75.44,74.6 | v99.19,74.6 100.31,74.6 v101.98,72.92 | v104.78,69.01 108.69,65.1 108.69,64.82 109.25,64.26 111.48,64.26 116.79,69.57 119.86,69.57 134.67,54.76 B1.A15
LCD_D0  (via drill 0.35)
  Top 0.406: v40.51,138.58 54.76,138.58 55.04,138.3 56.16,138.3 v60.91,133.55 | v114.55,124.89 114.55,103.1 v114,102.54 | v113.16,81.31 v113.16,97.51 | v100.86,56.16 100.86,53.92 99.19,52.25 B1.30
  Bottom 0.406: v40.51,138.58 29.06,138.58 25.15,142.49 24.59,142.49 X1.7 | v60.91,133.55 85.5,133.55 85.78,133.83 104.5,133.83 113.44,124.89 v114.55,124.89 | v114,102.54 114,98.35 v113.16,97.51 | v113.16,81.31 110.08,78.23 109.25,78.23 100.86,69.85 v100.86,56.16
LCD_D1  (via drill 0.35)
  Top 0.406: v33.53,141.38 53.09,121.82 60.63,121.82 v74.04,108.41 | v74.04,90.81 74.04,86.61 74.6,86.06 v74.6,77.11 | v83.82,58.95 83.82,57.28 83.54,57 83.54,50.85 v84.66,49.73
  Bottom 0.406: v33.53,141.38 33.53,143.61 32.69,144.45 28.78,144.45 27.1,142.77 X1.8 | v74.04,90.81 v74.04,108.41 | v74.6,77.11 74.6,76.56 77.11,74.04 77.11,65.66 v83.82,58.95 | v84.66,49.73 84.66,49.17 86.89,46.94 96.39,46.94 98.91,49.45 B1.31
LCD_D2  (via drill 0.35)
  Top 0.406: v55.32,139.14 41.07,139.14 38.56,141.66 38.56,143.61 37.72,144.45 31.29,144.45 29.62,142.77 X1.9 | v117.35,128.25 119.86,125.73 119.86,121.54 122.1,119.3 v122.1,112.04 | v120.14,96.39 120.14,93.88 v117.63,91.36 | v93.04,75.16 93.88,74.32 94.16,74.32 96.95,71.53 96.95,61.19 101.7,56.44 101.7,52.25 B1.32
  Bottom 0.406: v55.32,139.14 86.06,139.14 89.97,135.23 110.36,135.23 v117.35,128.25 | v122.1,112.04 122.1,99.47 122.38,99.19 122.38,98.63 v120.14,96.39 | v117.63,91.36 115.95,91.36 111.76,87.17 101.7,87.17 93.04,78.51 v93.04,75.16
LCD_D3  (via drill 0.35)
  Top 0.406: v2.52,86.61 2.52,99.19 5.03,101.7 5.03,104.78 31.85,131.6 31.85,142.49 X1.10 | v93.04,11.73 98.07,11.73 102.82,16.48 102.82,30.18 110.08,37.44 110.08,41.07 101.7,49.45 B1.33
  Bottom 0.406: v2.52,86.61 2.52,36.32 12.01,26.82 77.95,26.82 v93.04,11.73
LCD_D4  (via drill 0.35)
  Top 0.406: v65.94,127.41 55.6,137.74 39.67,137.74 34.92,142.49 X1.11 | v88.01,127.41 88.01,125.45 v94.44,119.02 | v102.54,97.79 104.5,97.79 v104.78,97.51 | v111.2,91.08 111.2,81.86 110.92,81.58 110.92,80.47 113.72,77.67 v113.72,76.83 | v109.53,65.1 109.53,63.7 110.36,62.87 110.36,59.23 104.22,53.09 104.22,52.25 B1.34
  Bottom 0.406: v88.01,127.41 v65.94,127.41 | v94.44,119.02 94.44,111.76 96.39,109.8 96.39,103.94 v102.54,97.79 | v111.2,91.08 v104.78,97.51 | v113.72,76.83 110.64,76.83 109.53,75.72 v109.53,65.1
LCD_D5  (via drill 0.35)
  Top 0.406: v41.63,140.82 45.82,140.82 46.38,140.26 48.9,140.26 49.73,141.1 54.48,141.1 70.13,125.45 v70.13,114.83 | v71.53,88.29 73.76,86.06 73.76,77.39 v73.48,77.11 | v79.35,62.31 v79.35,65.94 | v81.31,57.28 81.31,50.01 88.29,43.03 89.97,43.03 v93.04,46.1
  Bottom 0.406: v41.63,140.82 39.12,140.82 37.44,142.49 X1.12 | v70.13,114.83 70.13,113.16 71.25,112.04 71.25,88.57 v71.53,88.29 | v73.48,77.11 74.32,77.95 74.88,77.95 77.67,75.16 77.67,67.61 v79.35,65.94 | v79.35,62.31 79.35,59.23 v81.31,57.28 | v93.04,46.1 100.58,46.1 103.94,49.45 B1.35
LCD_D6  (via drill 0.35)
  Top 0.406: v44.15,144.45 67.89,144.45 v95.28,117.07 | v109.53,96.95 109.53,88.29 109.8,88.01 109.8,79.91 112.32,77.39 112.32,74.6 113.72,73.2 v113.72,70.13 | v111.2,65.1 111.2,59.23 106.73,54.76 106.73,52.25 B1.36
  Bottom 0.406: v44.15,144.45 41.63,144.45 39.95,142.77 X1.13 | v95.28,117.07 96.39,117.07 104.78,108.69 104.78,103.94 109.8,98.91 109.8,97.23 v109.53,96.95 | v113.72,70.13 113.72,67.61 v111.2,65.1
LCD_D7  (via drill 0.35)
  Top 0.406: v44.15,136.91 47.78,136.91 v61.47,123.22 | v72.92,70.97 v70.69,73.2 | v82.14,52.25 82.14,50.01 86.06,46.1 v88.29,46.1
  Bottom 0.406: v44.15,136.91 42.47,138.58 42.47,142.49 X1.14 | v61.47,123.22 61.47,120.98 70.69,111.76 v70.69,73.2 | v72.92,70.97 72.92,61.47 v82.14,52.25 | v88.29,46.1 91.92,46.1 92.76,45.26 102.26,45.26 106.45,49.45 B1.37
LCD_E  (via drill 0.35)
  Top 0.406: v8.38,129.08 21.79,142.49 X1.6 | v16.2,48.62 16.2,38.56 12.85,35.2 12.85,33.25 11.46,31.85 11.46,25.7 13.13,24.03 22.63,24.03 25.43,26.82 96.67,26.82 v105.61,35.76 | v96.67,39.95 96.67,49.45 B1.29
  Bottom 0.406: v8.38,129.08 8.38,108.13 5.03,104.78 5.03,91.92 2.52,89.41 2.52,87.73 3.63,86.61 3.63,60.07 15.09,48.62 v16.2,48.62 | v105.61,35.76 100.86,35.76 v96.67,39.95
LCD_RS  (via drill 0.35)
  Top 0.406: v50.01,143.33 67.89,143.33 95.28,115.95 95.28,110.92 98.35,107.85 v99.75,107.85 | v108.97,97.79 108.97,97.51 108.69,97.23 108.69,88.29 109.25,87.73 109.25,79.63 111.76,77.11 111.76,74.32 113.16,72.92 113.16,72.36 111.2,70.41 v103.1,70.41 | v100.03,55.6 96.67,52.25 B1.28
  Bottom 0.406: v50.01,143.33 47.22,146.13 20.4,146.13 17.04,142.77 X1.4 | v99.75,107.85 100.03,107.85 108.97,98.91 v108.97,97.79 | v103.1,70.41 101.7,69.01 101.7,55.88 101.14,55.32 100.31,55.32 v100.03,55.6
MCONTROLR1_INP1  (via drill 0.35)
  Top 0.406: v165.96,88.57 166.24,88.85 166.24,90.53 165.12,91.64 164.85,91.64 164.01,92.48 IC2.5 | v145.01,34.92 v169.6,59.51 | v136.91,34.92 129.92,34.92 122.38,42.47 117.63,42.47 v115.11,44.98
  Bottom 0.406: v165.96,88.57 168.2,86.33 168.2,76 169.6,74.6 v169.6,59.51 | v136.91,34.92 v145.01,34.92 | v115.11,44.98 113.72,44.98 109.25,49.45 B1.39
MCONTROLR1_INP2  (via drill 0.35)
  Top 0.406: v157.86,114.28 v163.17,108.97 | v137.74,119.86 136.35,119.86 132.99,123.22 131.32,123.22 130.76,122.66 130.76,119.3 131.04,119.02 131.04,110.64 v126.57,106.17 | v127.13,89.41 127.13,88.57 123.5,84.94 123.5,77.67 118.19,72.36 118.19,65.66 117.63,65.1 v117.63,57.84
  Bottom 0.406: v163.17,108.97 166.24,105.89 166.24,97.51 164.01,95.28 IC2.7 | v157.86,114.28 143.33,114.28 v137.74,119.86 | v126.57,106.17 126.57,91.08 126.29,90.81 126.29,90.25 v127.13,89.41 | v117.63,57.84 111.76,51.97 B1.40
MCONTROLR1_INP3  (via drill 0.35)
  Top 0.406: v148.92,79.35 151.16,81.58 151.16,91.64 157.3,97.79 157.58,97.79 158.7,98.91 IC2.10 | v148.92,74.88 151.16,72.64 151.16,68.73 v154.23,65.66 | v154.23,60.63 154.23,59.51 155.91,57.84 155.91,57.28 v140.82,42.19 | v121.54,34.92 111.76,44.7 B1.41
  Bottom 0.406: v148.92,74.88 v148.92,79.35 | v154.23,60.63 v154.23,65.66 | v140.82,42.19 135.51,42.19 128.25,34.92 v121.54,34.92
MCONTROLR1_INP4  (via drill 0.35)
  Top 0.406: v156.46,103.38 156.46,105.61 v157.3,106.45 | v138.02,82.42 136.07,80.47 v136.07,76.83 | v95.83,80.19 96.39,80.19 101.14,75.44 101.14,70.13 v103.1,68.17 | v110.92,55.6 114.28,52.25 B1.42
  Bottom 0.406: v156.46,103.38 158.14,101.7 158.7,101.7 IC2.12 | v157.3,106.45 153.67,106.45 147.24,100.03 144.45,100.03 138.02,93.6 v138.02,82.42 | v136.07,76.83 135.23,76 129.36,76 118.75,86.61 102.26,86.61 v95.83,80.19 | v103.1,68.17 103.1,63.42 v110.92,55.6
MCONTROLR2_INP1  (via drill 0.35)
  Top 0.406: v143.05,38.84 v163.45,59.23 | v126.85,33.53 v134.39,33.53 | v124.05,33.53 114.28,43.31 114.28,49.45 B1.43
  Bottom 0.406: v163.45,59.23 166.24,62.03 166.24,70.13 164.01,72.36 IC1.5 | v143.05,38.84 139.7,38.84 v134.39,33.53 | v124.05,33.53 v126.85,33.53
MCONTROLR2_INP2  (via drill 0.35)
  Top 0.406: v168.76,74.32 168.2,74.88 164.01,74.88 IC1.7 | v168.76,62.03 168.76,61.19 155.91,48.34 155.35,48.34 151.44,44.42 151.44,42.19 145.85,36.6 129.92,36.6 117.07,49.45 B1.45
  Bottom 0.406: v168.76,62.03 v168.76,74.32
MCONTROLR2_INP3  (via drill 0.35)
  Top 0.406: v150.6,78.79 151.44,79.63 152.55,79.63 153.39,78.79 158.7,78.79 IC1.10 | v140.54,68.73 v142.77,70.97 | v128.52,73.76 118.47,63.7 118.47,53.09 119.3,52.25 B1.46
  Bottom 0.406: v150.6,78.79 150.6,75.44 146.13,70.97 v142.77,70.97 | v140.54,68.73 139.14,68.73 136.07,71.81 136.07,72.92 135.23,73.76 v128.52,73.76
MCONTROLR2_INP4  (via drill 0.35)
  Top 0.406: v151.16,60.63 151.16,58.4 v150.04,57.28 | v149.76,49.17 139.42,38.84 139.42,38.56 138.86,38 137.47,38 129.92,45.54 122.1,45.54 119.58,48.06 119.58,49.45 B1.47
  Bottom 0.406: v151.16,60.63 151.16,66.5 151.71,67.06 153.39,67.06 155.91,69.57 155.91,78.79 158.14,81.03 158.7,81.03 IC1.12 | v150.04,57.28 150.04,49.45 v149.76,49.17
N$5
  Top 0.406: 12V_REG.2 8.66,65.1 8.66,65.66 12.57,69.57 D1.1
N$10
  Top 0.406: 5V_REG.2 21.51,65.1 21.51,65.94 25.15,69.57 D2.1
N$11
  Top 0.406: 3V3_REG.2 34.09,65.1 34.09,65.66 38,69.57 D3.1
N$12  (via drill 0.35)
  Top 0.406: D5.C 152.27,66.22 150.6,66.22 147.52,69.29 147.52,69.85 D16.C 147.24,69.85 146.13,70.97 146.13,73.76 145.01,74.88 145.01,77.39 D8.C 145.01,77.67 139.7,82.98 D15.C | v167.36,85.78 167.36,93.32 169.32,95.28 169.88,95.28 172.95,98.35 172.95,106.17 170.43,108.69 170.43,110.36 MC1_VS.P1 | D7.C 152.55,77.39 156.46,73.48 156.46,73.2 158.7,70.97 IC1.4 | IC2.4 158.7,91.36 157.58,90.25 157.3,90.25 153.67,86.61 153.67,82.42 152.55,81.31 D6.C
  Bottom 0.406: D13.C D14.C C7.1 139.7,62.31 143.61,66.22 143.61,66.5 146.96,69.85 D16.C | C4.1 152.55,101.42 152.55,99.47 156.46,95.56 156.46,93.32 158.14,91.64 158.7,91.64 IC2.4 | D7.C 152.55,77.67 152.55,81.03 D6.C | v167.36,85.78 165.41,83.82 162.33,83.82 160.93,82.42 160.93,72.92 158.98,70.97 IC1.4 158.7,71.25 153.67,66.22 152.55,66.22 D5.C
N$14
  Top 0.406: J4.1 68.45,81.31 66.22,81.31 J4.2 65.94,81.31 63.7,81.31 J4.3 63.42,81.31 61.19,81.31 J4.4 60.91,81.31 58.67,81.31 J4.5 58.4,81.31 55.88,81.31 | D3.2 38.28,72.64 42.47,72.64 50.85,81.03 J4.8 50.85,81.31 53.09,81.31 J4.7 53.37,81.31 55.88,81.31 | 55.88,81.31 J4.6
N$16  (via drill 0.35)
  Top 0.406: v62.87,104.78 U2.P$22
  Bottom 0.406: v62.87,104.78 60.91,104.78 55.88,99.75 55.04,99.75 48.9,93.6 48.9,89.97 48.34,89.41 48.34,88.29 47.5,87.45 46.1,87.45 44.7,88.85 LED2.7 44.42,88.85 41.91,86.33 21.51,86.33 19.84,88.01 19.84,88.29 19.28,88.85 LED1.7
N$17
  Top 0.406: U2.P$21 64.26,106.45 64.26,105.61 64.82,105.05 72.36,105.05 72.64,105.33 72.64,108.97 60.35,121.26 24.31,121.26 7.54,104.5 7.54,103.38 3.91,99.75 3.91,89.13 LED1.1 3.91,88.85 5.87,86.89 21.51,86.89 22.91,88.29 22.91,89.41 23.75,90.25 26.26,90.25 27.38,89.13 29.06,89.13 LED2.1
N$18  (via drill 0.35)
  Top 0.406: v65.38,108.97 65.38,106.73 U2.P$20 | v58.95,115.67 56.72,117.91 v42.19,117.91 | v22.91,87.17 19.84,84.1 3.91,84.1 1.4,86.61 1.4,100.86 3.63,103.1 3.63,103.94 LED1.18
  Bottom 0.406: v65.38,108.97 58.95,115.39 v58.95,115.67 | 29.48,105.19 29.34,105.05 29.34,104.22 LED2.18 | 29.48,105.19 v42.19,117.91 | v22.91,87.17 21.51,87.17 20.4,88.29 20.4,89.41 21.23,90.25 21.23,101.98 22.91,103.66 22.91,104.78 23.47,105.33 29.34,105.33 29.48,105.19
N$19
  Top 0.406: R3.2 64.82,90.53 68.73,90.53 74.88,96.67 74.88,99.47 A1.1
N$20
  Top 0.406: R4.2 62.31,92.48 62.87,92.48 63.98,93.6 68.45,93.6 68.73,93.32 70.69,93.32 73.76,96.39 73.76,101.98 74.04,102.26 79.07,102.26 79.91,101.42 79.91,100.86 78.79,99.75 77.67,99.75 A0.1
N$21  (via drill 0.35)